# Altium project PV Refridgerator.PrjPCB (part 2 of 2)

## Sheet Current Sense.SchDoc: Vsense from 0 to 69.3V
size Letter; Date: 2017-02-08; DocumentNumber: 15; Revision: A; SheetNumber: 15; SheetTotal: 16; DesignedBy: Mike MacKay
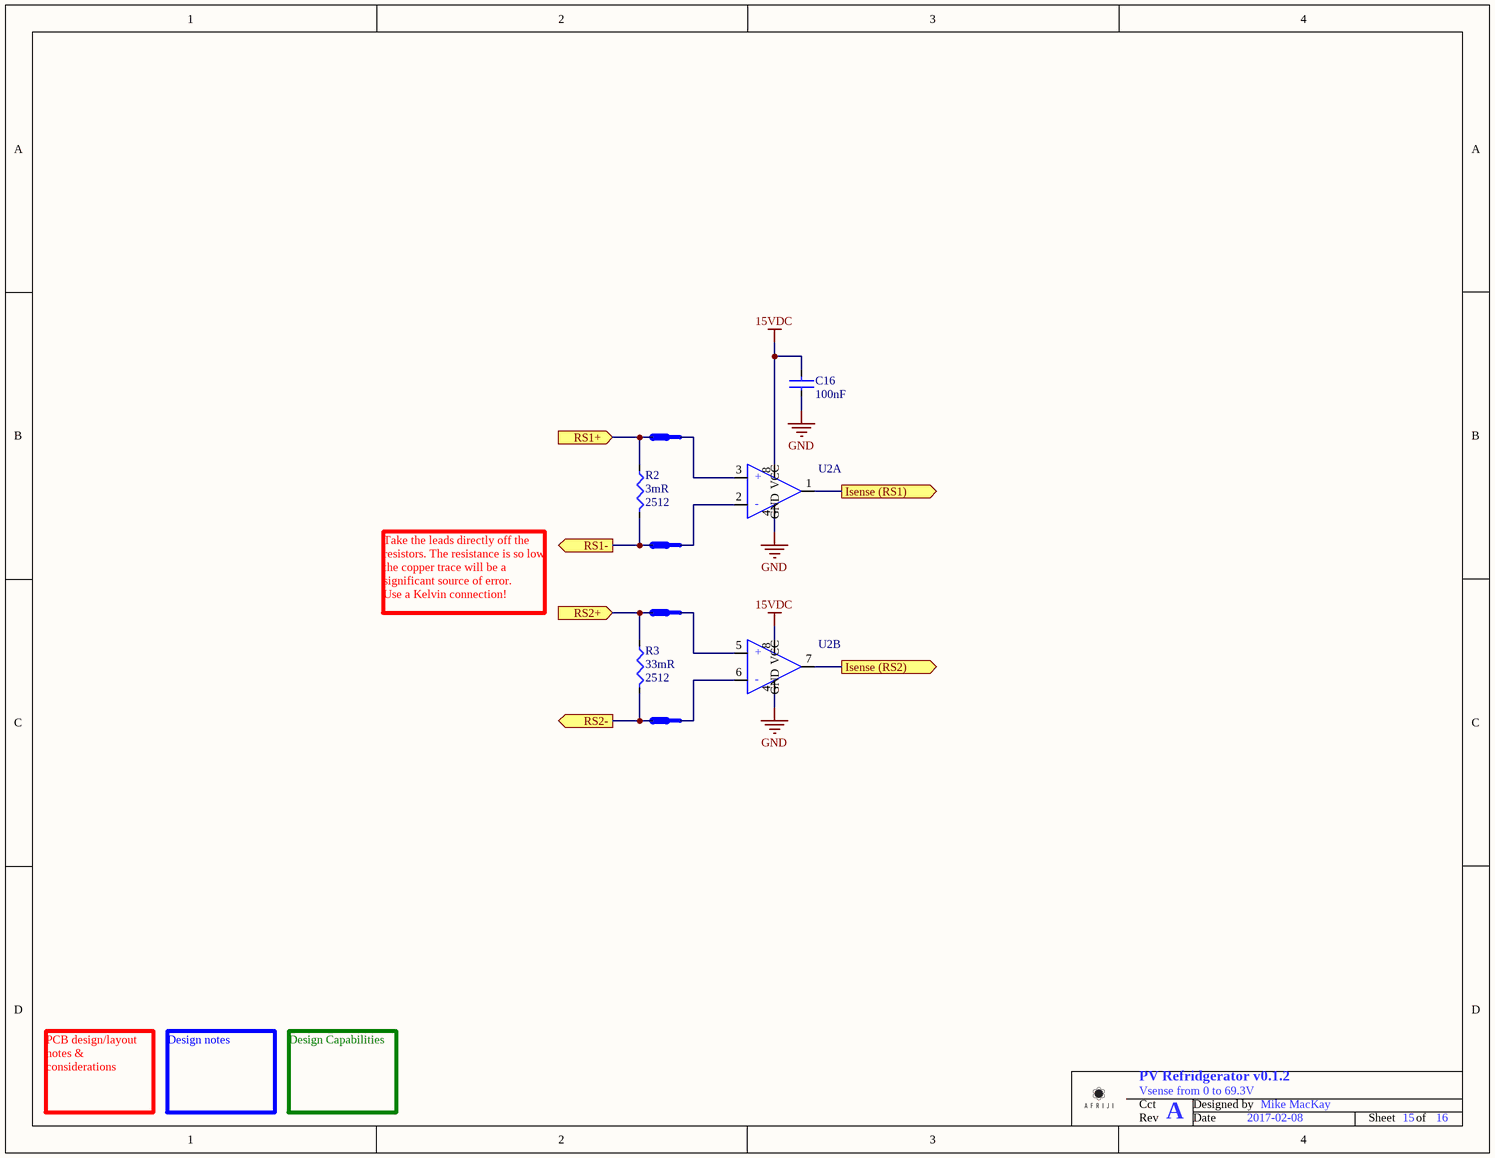
[diagram p8: Current Sense.SchDoc]

### Parts
C16  Capacitance: 100nF  [C0603 - Ceramic]  (hidden comment: 100nF 0603 50V)
NetTie3  Net Tie  [Net tie (7/35 mil)]  (value not drawn)  (net tie, no BOM)
NetTie4  Net Tie  [Net tie (7/7 mil)]  (value not drawn)  (net tie, no BOM)
NetTie5  Net Tie  [Net tie (7/35 mil)]  (value not drawn)  (net tie, no BOM)
NetTie6  Net Tie  [Net tie (7/7 mil)]  (value not drawn)  (net tie, no BOM)
R2  Resistance (Ohms): 3mR  Supplier Device Package: 2512  [R2512]  (hidden comment: 3mR 2512 1%)
R3  Resistance (Ohms): 33mR  Supplier Device Package: 2512  [R2512]  (hidden comment: 33mR 2512 1%)
U2  Dual High Side Current Sense Amplifier  [SOIC-8 (3.9mm)]  (value not drawn)  (parts A,B of 2)

### Ports
Isense (RS1) (out), Isense (RS2) (out), RS1+ (in), RS1- (out), RS2+ (in), RS2- (out)

### Nets
0V: NetTie4.2 R2.1 ; port RS1-
15VDC: C16.1 U2.8(VCC)
GND: C16.2 U2.4(GND)
-DC Bus: NetTie6.2 R3.1 ; port RS2-
Isense (RS1): U2.1(Out) ; port Isense (RS1)
Isense (RS2): U2.7(OUT2) ; port Isense (RS2)
NetNetTie3_1: NetTie3.1 U2.3(RS1+)
NetNetTie3_2: NetTie3.2 R2.2 ; port RS1+
NetNetTie4_1: NetTie4.1 U2.2(RS1-)
NetNetTie5_1: NetTie5.1 U2.5(RS2+)
NetNetTie5_2: NetTie5.2 R3.2 ; port RS2+
NetNetTie6_1: NetTie6.1 U2.6(RS2-)

### Notes on the sheet
- Take the leads directly off the resistors. The resistance is so low the copper trace will be a significant source of error.
  Use a Kelvin connection!
- PCB design/layout notes & considerations
- Design notes
- Design Capabilities
- Cct
- Designed by
- Rev
- Date
- Sheet
- of
- (in symbol Dual High Side Current Sense Amplifier, part A) +
- (in symbol Dual High Side Current Sense Amplifier, part B) +

### Library data of the parts
C16 = 100nF 0603 50V: Manufacturer: Samsung Electro-Mechanics America, Inc; Manufacturer Part Number: CL10B104KB8SFNC; Tolerance: ±10%; Temperature Coefficient: X7R; Value: 100nF 0603 50V; Supplier 1: Digi-Key; RoHS: RoHS Compliant; Category: Capacitors; Stock 1: 1192070; Pricing 1: 1=0.1, 10=0.027, 25=0.0192, 100=0.0125, 500=0.00874, 1000=0.00681 (USD); Packaging: Cut Tape (CT); Voltage - Rated: 50V; Mounting Type: Surface Mount, MLCC; Operating Temperature: -55°C ~ 125°C; Applications: Boardflex Sensitive; Ratings: -; Package / Case: 0603 (1608 Metric); Size / Dimension: 0.063" L x 0.031" W (1.60mm x 0.80mm); Height - Seated (Max): -; Thickness (Max): 0.035" (0.90mm); Lead Spacing: -; Features: Soft Termination; Lead Style: -; ComponentLink1URL: http://www.samsungsem.com/kr/front/downloadcms.do?path=/kr/support/product-search/mlcc/__icsFiles/afieldfile/2014/11/05&fileName=S_CL10B104KB8SFNC.pdf; ComponentLink1Description: http://www.samsungsem.com/kr/front/downloadcms.do?path=/kr/support/product-search/mlcc/__icsFiles/afieldfile/2014/11/05&fileName=S_CL10B104KB8SFNC.pdf; Supplier Part Number 1: 1276-1936-1-ND
NetTie3-NetTie6 = Net Tie: Ties two nets together
R2 = 3mR 2512 1%: Manufacturer: Yageo; Manufacturer Part Number: PR2512FKF070R003L; Power (Watts): 1W; Temperature Coefficient: ±100ppm/°C; Value: 3mR 2512 1%; Supplier 1: Digi-Key; Supplier Part Number 1: 311-0.003AGCT-ND; RoHS: RoHS Compliant; Category: Resistors; Stock 1: 16866; Pricing 1: 1=0.65, 10=0.544, 25=0.466, 50=0.4196, 100=0.3652, 250=0.32632, 500=0.26416, 1000=0.21366 (USD); Packaging: Cut Tape (CT); Part Status: Active; Tolerance: ±1%; Composition: Thick Film; Features: Current Sense; Operating Temperature: -55°C ~ 170°C; Package / Case: 2512 (6432 Metric); Size / Dimension: 0.252" L x 0.126" W (6.40mm x 3.20mm); Height - Seated (Max): 0.041" (1.03mm); Number of Terminations: 2; Failure Rate: -; ComponentLink1URL: http://www.yageo.com/NewPortal/yageodocoutput?fileName=/pdf/R-Chip/-PYu-PR_51_RoHS_Z_0.pdf; ComponentLink1Description: Spec Sheet
R3 = 33mR 2512 1%: Manufacturer: Yageo; Manufacturer Part Number: RL2512FK-070R033L; Power (Watts): 1W; Temperature Coefficient: ±1200ppm/°C; Value: 3mR 2512 1%; Supplier 1: Digi-Key; Supplier Part Number 1: 311-.033TCT-ND; RoHS: RoHS Compliant; Category: Resistors; Stock 1: 13739; Pricing 1: 1=0.61, 10=0.453, 25=0.3676, 50=0.3196, 100=0.2636, 250=0.229, 500=0.1864, 1000=0.14784 (USD); Packaging: Cut Tape (CT); Part Status: Active; Tolerance: ±1%; Composition: Thick Film; Features: Automotive AEC-Q200, Current Sense, Moisture Resistant; Operating Temperature: -55°C ~ 155°C; Package / Case: 2512 (6432 Metric); Size / Dimension: 0.250" L x 0.126" W (6.35mm x 3.20mm); Height - Seated (Max): 0.026" (0.65mm); Number of Terminations: 2; Failure Rate: -; ComponentLink1URL: http://www.yageo.com/documents/recent/PYu-RL_Group_521_RoHS_L%201.pdf; ComponentLink1Description: http://www.yageo.com/documents/recent/PYu-RL_Group_521_RoHS_L%201.pdf
U2 = Dual High Side Current Sense Amplifier: Manufacturer: Maxim Integrated; Manufacturer Part Number: MAX4377FASA+; Number of Circuits: 2; Slew Rate: 10 V/µs; -3db Bandwidth: 1.7MHz; Current - Input Bias: 800µA; Current - Supply: 1mA; Voltage - Supply, Single/Dual (±): 3 V ~ 28 V; Supplier 1: Digi-Key; RoHS: RoHS Compliant; Category: Integrated Circuits (ICs); Stock 1: 695; Pricing 1: 1=1.98, 10=1.881, 50=1.8742 (USD); Packaging: Tube; Part Status: Active; Amplifier Type: Current Sense; Output Type: -; Gain Bandwidth Product: -; Voltage - Input Offset: -; Current - Output / Channel: -; Operating Temperature: -40°C ~ 125°C; Mounting Type: Surface Mount; Package / Case: 8-SOIC (0.154", 3.90mm Width); Supplier Device Package: 8-SOIC; ComponentLink1URL: https://datasheets.maximintegrated.com/en/ds/MAX4376-MAX4378.pdf; ComponentLink1Description: Spec Sheet; Supplier Part Number 1: MAX4377FASA+-ND

## Nets that join several sheets
0V: Overview (J3.2 NetTie2.2), Current Sense (NetTie4.2 R2.1)
15VDC: High Current H-Bridge/Half H-Bridge Driver (C13A.1 D8A.1 U6A.5), High Current H-Bridge/Half H-Bridge Driver (C13B.1 D8B.1 U6B.5), High Voltage H-Bridge/Half H-Bridge Driver (C13C.1 D8C.1 U6C.5), High Voltage H-Bridge/Half H-Bridge Driver (C13D.1 D8D.1 U6D.5), Current Sense (C16.1 U2.8)
+Vsolar: Overview (J3.1 NetTie7.2), High Current H-Bridge (Q1.2 Q2.2)
GND: Overview (NetTie2.1 NetTie?.2), High Current H-Bridge/Half H-Bridge Driver (C13A.2 U6A.3), High Current H-Bridge/Half H-Bridge Driver (C13B.2 U6B.3), High Voltage H-Bridge/Half H-Bridge Driver (C13C.2 U6C.3), High Voltage H-Bridge/Half H-Bridge Driver (C13D.2 U6D.3), Microcontroller (9 pins), Vsense 0-69.3V (R20A.1), Current Sense (C16.2 U2.4), Vsense (0-69.3V) (R20B.1), Vsense 0-69.3V (R20C.1)
HVGND: Overview (NetTie?.1), Transformer (J8.1 T1.1), Vsense 0-223 (R15A.1), Vsense 0-223 (R15B.1), Vsense 0-223 (R15C.1), Vsense 0-223 (R15D.1)
+DC Bus: High Voltage H-Bridge (Q5.2 Q6.2), Vsense 0-223 (R14B.2)
+VT1.P: Overview (NetTie8.2), High Current H-Bridge (C1.1 Q1.3 Q3.2), High Current H-Bridge/Half H-Bridge Driver (NetTie1A.2), Transformer (J7.2 T1.8 T1.12)
+VT1.S: Transformer (J8.2 T1.6), Vsense 0-223 (R14A.2)
-VT1.P: Overview (NetTie9.2), High Current H-Bridge (C1.2 Q2.3 Q4.2), High Current H-Bridge/Half H-Bridge Driver (NetTie1B.2), Transformer (J7.1 T1.7 T1.11)
A_HO: High Current H-Bridge (Q1.1), High Current H-Bridge/Half H-Bridge Driver (R12A.2)
A_LO: High Current H-Bridge (Q4.1), High Current H-Bridge/Half H-Bridge Driver (R13A.2)
B_HO: High Current H-Bridge (Q2.1), High Current H-Bridge/Half H-Bridge Driver (R12B.2)
B_LO: High Current H-Bridge (Q3.1), High Current H-Bridge/Half H-Bridge Driver (R13B.2)
C_HO: High Voltage H-Bridge (Q5.1), High Voltage H-Bridge/Half H-Bridge Driver (R12C.2)
C_LO: High Voltage H-Bridge (Q8.1), High Voltage H-Bridge/Half H-Bridge Driver (R13C.2)
C_VS: Overview (J6.1), High Voltage H-Bridge (C2.1 C3.1 Q5.3 Q7.2), High Voltage H-Bridge/Half H-Bridge Driver (NetTie1C.2), Vsense 0-223 (R14C.2)
D_HO: High Voltage H-Bridge (Q6.1), High Voltage H-Bridge/Half H-Bridge Driver (R12D.2)
D_LO: High Voltage H-Bridge (Q7.1), High Voltage H-Bridge/Half H-Bridge Driver (R13D.2)
D_VS: Overview (J6.2), High Voltage H-Bridge (C2.2 C3.2 Q6.3 Q8.2), High Voltage H-Bridge/Half H-Bridge Driver (NetTie1D.2), Vsense 0-223 (R14D.2)
Isense (RS1): Microcontroller (U1.22), Current Sense (U2.1)
Isense (RS2): Microcontroller (U1.23), Current Sense (U2.7)
LOA HiA: High Current H-Bridge/Half H-Bridge Driver (U6A.1 U6A.2), Microcontroller (U1.53)
LOA HiV: High Voltage H-Bridge/Half H-Bridge Driver (U6D.1 U6D.2), Microcontroller (U1.31)
LOB HiA: High Current H-Bridge/Half H-Bridge Driver (U6B.1 U6B.2), Microcontroller (U1.52)
LOB HiV: High Voltage H-Bridge/Half H-Bridge Driver (U6C.1 U6C.2), Microcontroller (U1.32)
NetNetTie3_2: High Current H-Bridge (Q3.3 Q4.3), Current Sense (NetTie3.2 R2.2)
NetNetTie5_2: High Voltage H-Bridge (Q7.3 Q8.3), Current Sense (NetTie5.2 R3.2)
NetNetTie7_1: Overview (NetTie7.1), Vsense (0-69.3V) (R11B.2)
NetNetTie8_1: Overview (NetTie8.1), Vsense 0-69.3V (R11A.2)
NetNetTie9_1: Overview (NetTie9.1), Vsense 0-69.3V (R11C.2)
Vsense (+T1 S): Microcontroller (U1.28), Vsense 0-223 (R14A.1 R15A.2)
Vsense (+T1.P): Microcontroller (U1.15), Vsense 0-69.3V (R11A.1 R20A.2)
Vsense (+Vdc Bus): Microcontroller (U1.27), Vsense 0-223 (R14B.1 R15B.2)
Vsense (+Vout): Microcontroller (U1.29), Vsense 0-223 (R14C.1 R15C.2)
Vsense (+Vsolar): Microcontroller (U1.14), Vsense (0-69.3V) (R11B.1 R20B.2)
Vsense (-T1.P): Microcontroller (U1.16), Vsense 0-69.3V (R11C.1 R20C.2)
Vsense (-Vout): Microcontroller (U1.30), Vsense 0-223 (R14D.1 R15D.2)